# EAGLE design ddrive-esp-deadrail-1-6 (EAGLE 7.5.0)
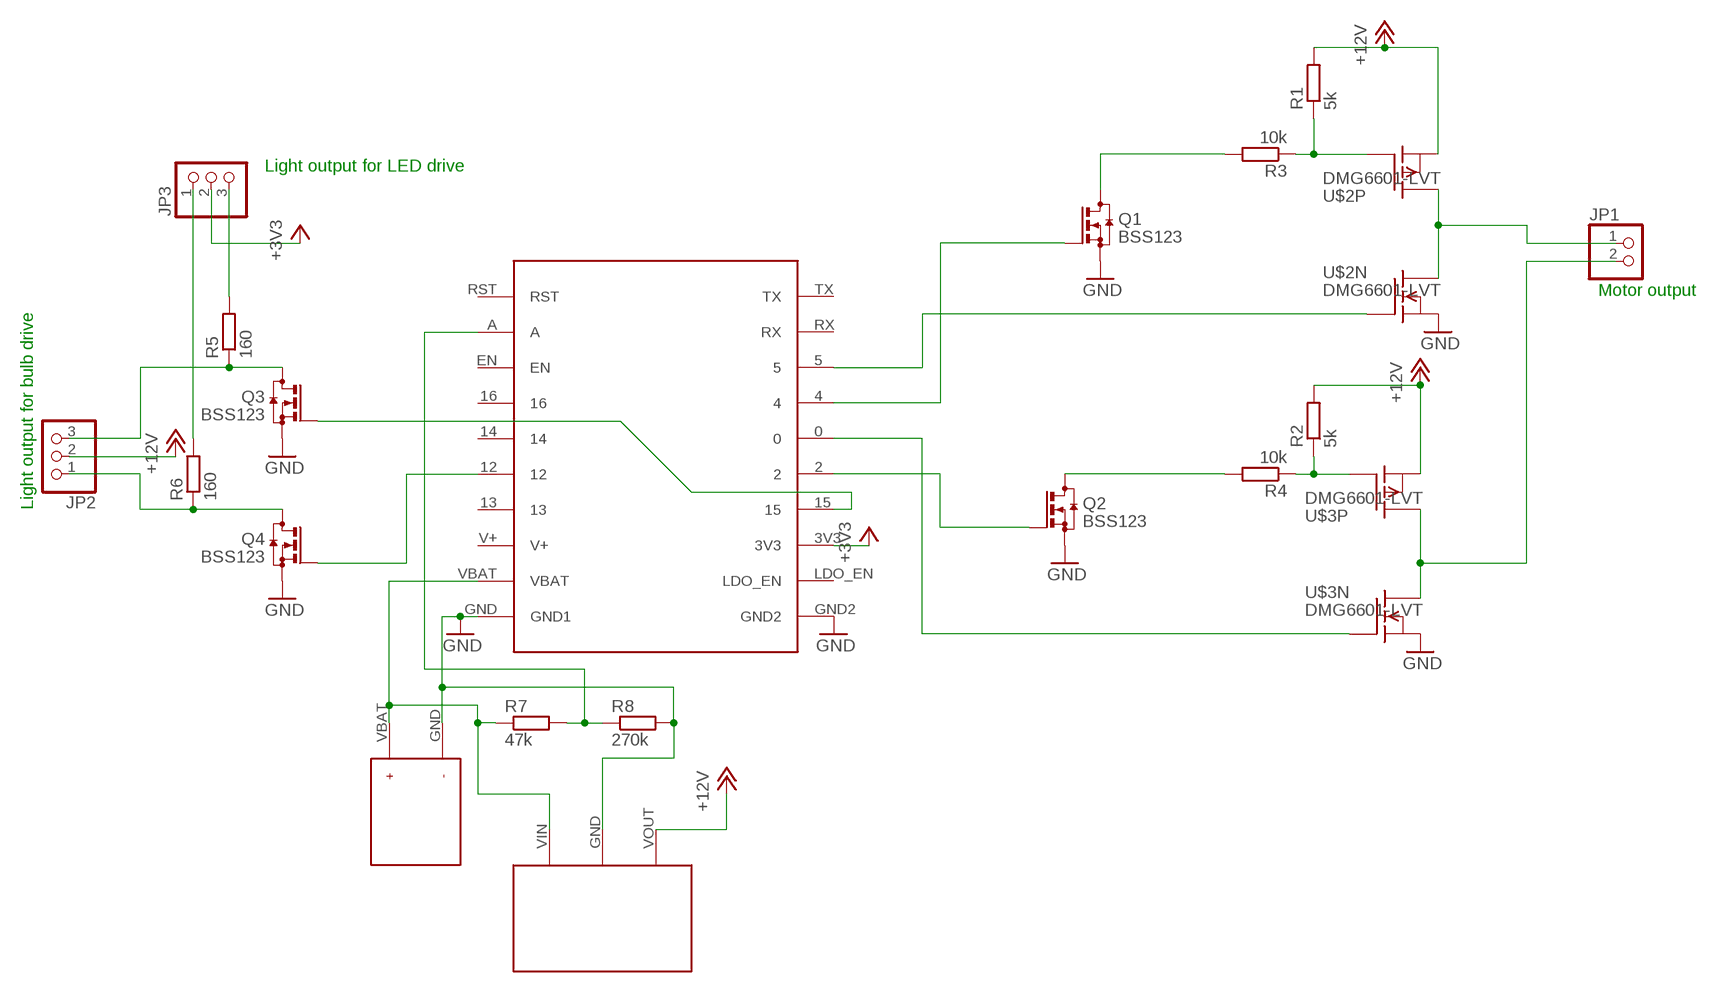
[diagram p0: schematic, sheet 1]

## Parts
JP1  PINHD-1X2  [1X02]
JP2  PINHD-1X3  [1X03]
JP3  PINHD-1X3  [1X03]
Q1  BSS123  [SOT23]
Q2  BSS123  [SOT23]
Q3  BSS123  [SOT23]
Q4  BSS123  [SOT23]
R1  5k  R-EU_R0805  [R0805]
R2  5k  R-EU_R0805  [R0805]
R3  10k  R-EU_R0805  [R0805]
R4  10k  R-EU_R0805  [R0805]
R5  160  R-EU_R0805  [R0805]
R6  160  R-EU_R0805  [R0805]
R7  47k  R-EU_R0805  [R0805]
R8  270k  R-EU_R0805  [R0805]
U$1  ESP12-HUZZAH  [ESP12-HUZZAH]
U$2  DMG6601-LVT  [TSOT-26]
U$3  DMG6601-LVT  [TSOT-26]
U$4  JST-PINHD  [JST-PINHDR]
U$5  POLOLU-VREG12  [POLOLU-REGULATOR]

## Nets
+3V3: JP3.2 U$1.3V3
+12V: JP2.2 R1.2 R2.2 U$2.2(P:S) U$3.2(P:S) U$5.VOUT
GND: Q1.2(S) Q2.2(S) Q3.2(S) Q4.2(S) R8.2 U$1.GND2 U$1.GND(GND1) U$2.5(N:S) U$3.5(N:S) U$4.GND U$5.GND
N$1: JP1.1 U$2.4(P:D) U$2.6(N:D)
N$2: R1.1 R3.1 U$2.3(P:G)
N$3: Q2.3(D) R4.2
N$4: R2.1 R4.1 U$3.3(P:G)
N$5: Q1.1(G) U$1.4
N$6: Q1.3(D) R3.2
N$7: JP1.2 U$3.4(P:D) U$3.6(N:D)
N$8: U$1.5 U$2.1(N:G)
N$9: Q2.1(G) U$1.2
N$10: U$1.0 U$3.1(N:G)
N$11: Q3.1(G) U$1.15
N$12: Q4.1(G) U$1.12
N$13: JP2.3 Q3.3(D) R5.1
N$14: JP2.1 Q4.3(D) R6.1
N$15: JP3.3 R5.2
N$16: JP3.1 R6.2
N$19: R7.2 R8.1 U$1.A
VBAT: R7.1 U$1.VBAT U$4.VBAT U$5.VIN
Unconnected: U$1.13 U$1.14 U$1.16 U$1.EN U$1.LDO_EN U$1.RST U$1.RX U$1.TX

## Notes on the sheet
- Light output for LED drive
- Motor output
- Light output for bulb drive

## Power pins joined to a net without a drawn wire
V+: U$1.V+

## Library data of the parts
JP1 = pinhead:PINHD-1X2: PIN HEADER
JP2 JP3 = pinhead:PINHD-1X3: PIN HEADER
Q1-Q4 = transistor-small-signal:BSS123: N-CHANNEL MOS FET
R1-R8 = rcl:R-EU_: RESISTOR, European symbol
U$1 = trainlib:ESP12-HUZZAH
U$2 U$3 = trainlib:DMG6601-LVT: Dual N+P-channel MOSFET. Package: TSOT-26 Vmax=30V N-channel: 55mOhm, 3.8A Imax P-channel: 110mOhm, 2.5A Imax
U$4 = trainlib:JST-PINHD
U$5 = trainlib:POLOLU-VREG12

## Board
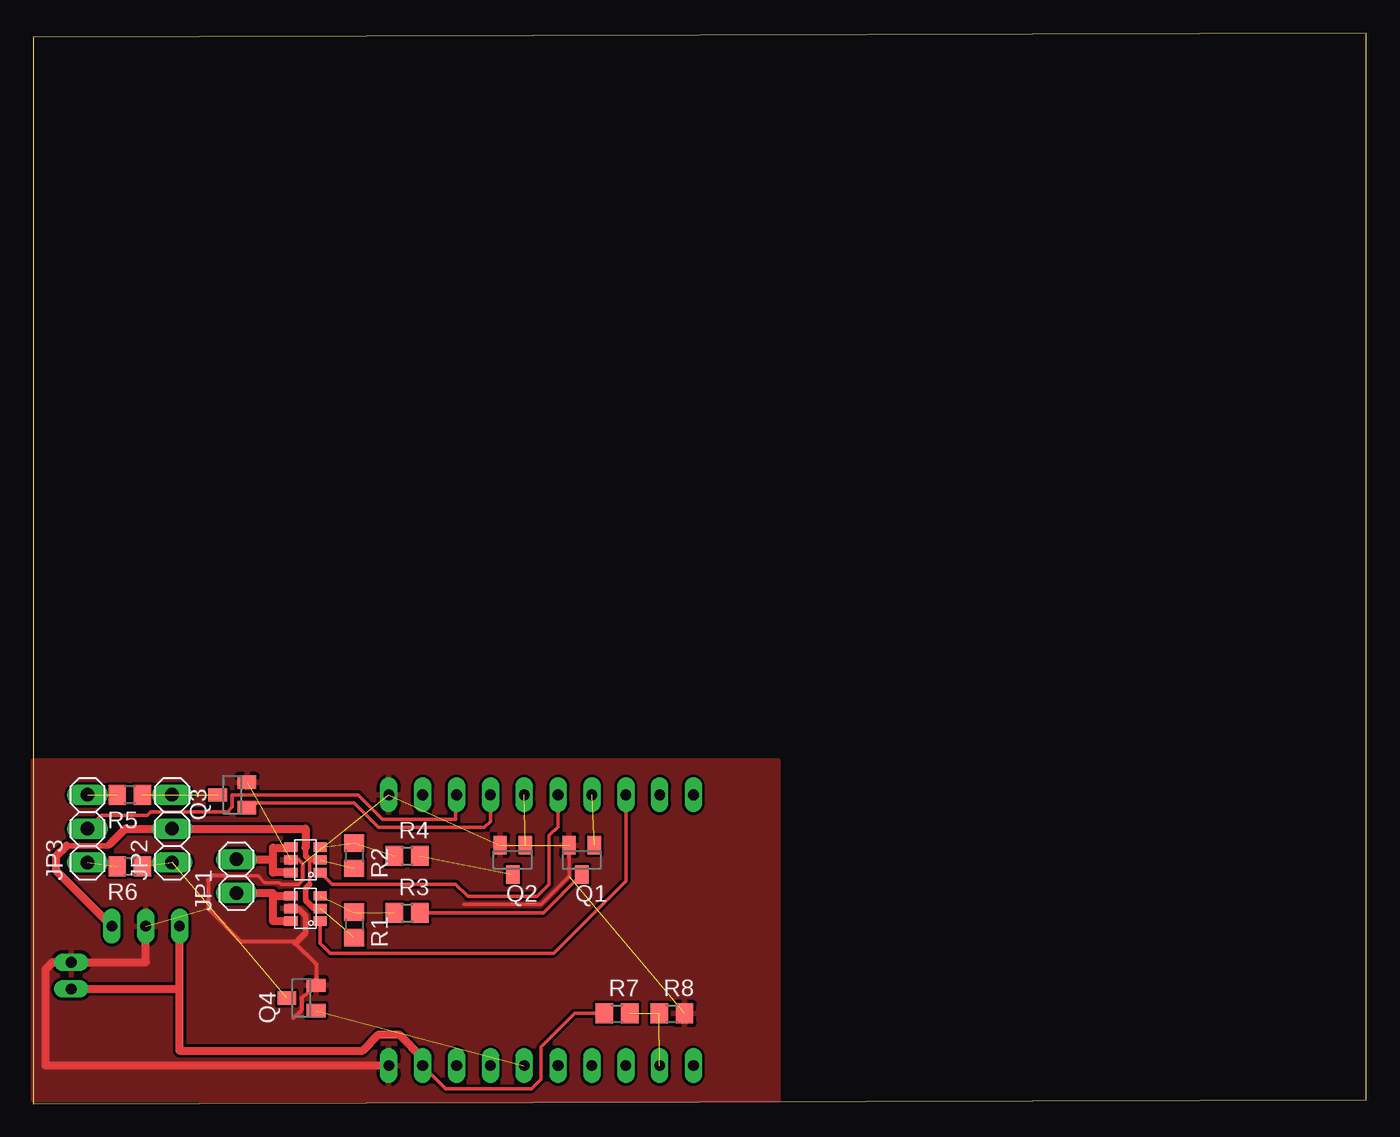
[diagram p1: board, top side]
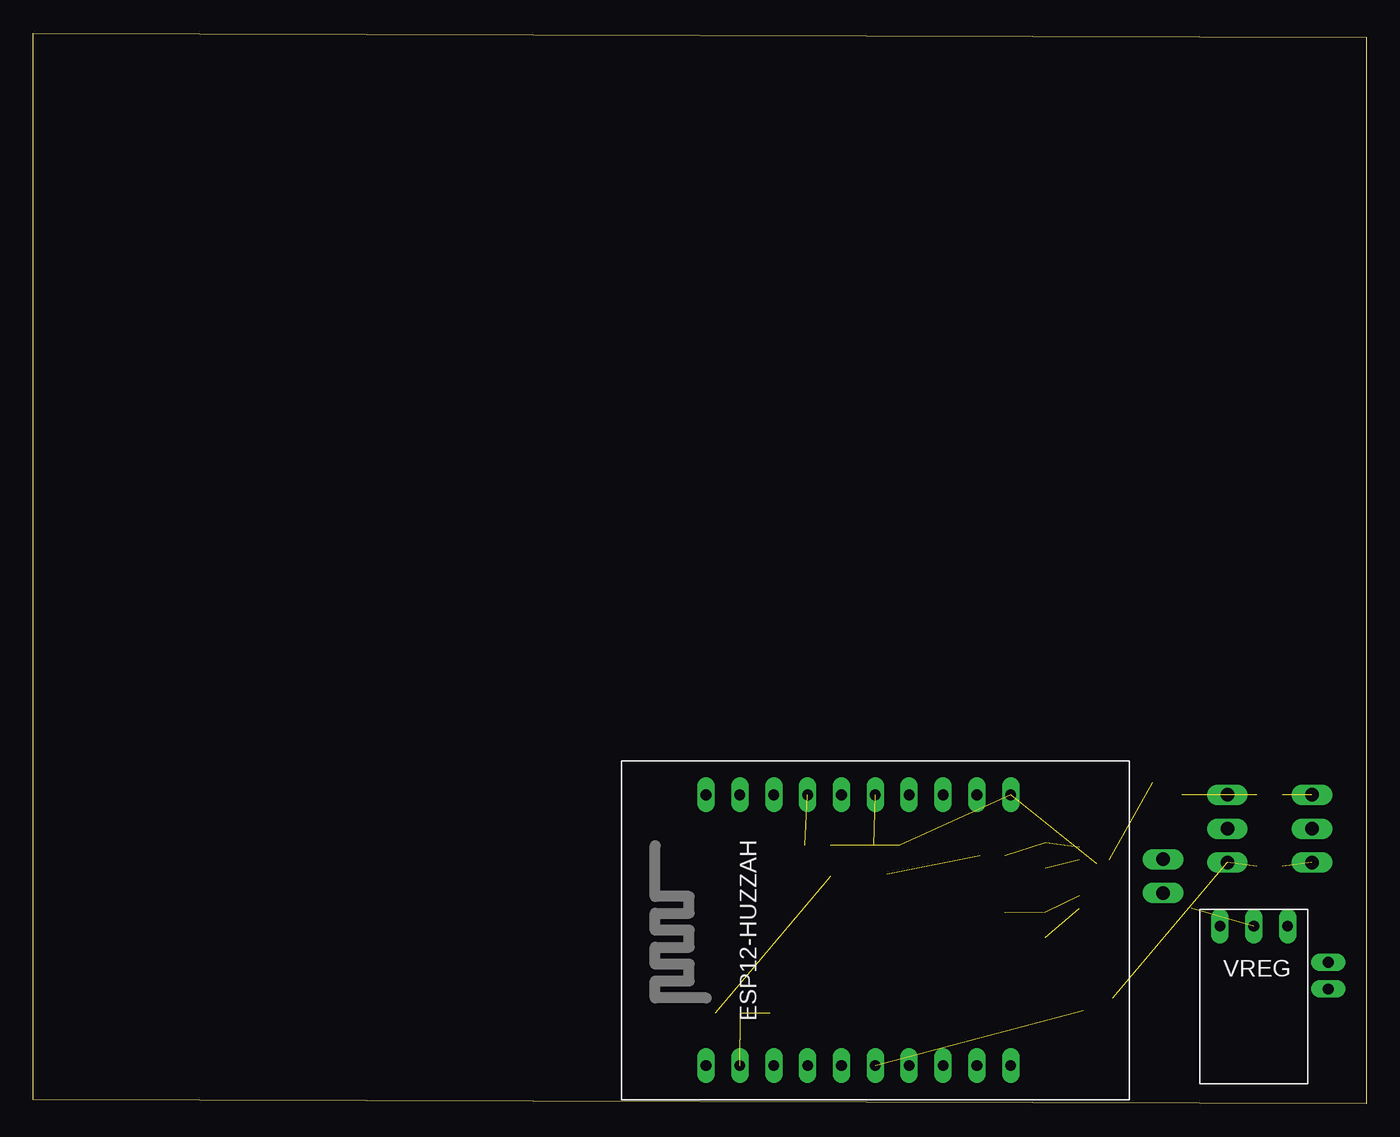
[diagram p2: board, bottom side, seen from below]

Size 100 x 80.3 mm. Coordinates in mm from the lower left corner, seen from the top.
Outline: 0,0 100,0.3 100,80.3 0,80 0,0
Copper layers (1*16): Top 0.035mm / dielectric 1.5mm / Bottom 0.035mm
Design rules "self-etch": minimum track width 8mil, minimum drill 24mil, track to track 8mil, track to pad 8mil, pad to pad 8mil, via to via 8mil, smd to smd 0mil, copper to edge 0mil, drill to drill 8mil, minimum pad ring 10mil, minimum via ring 8mil, stop-mask expansion 4mil, vias tented up to drill 0mil, thermal gap 10mil

### Footprints (pad centres in the part's own frame; a part is rotated, then mirrored left to right if it is on the bottom)
1X02 = drill 1.016 long: 1 -1.27,0; 2 1.27,0
1X03 = drill 1.016 long: 1 -2.54,0; 2 0,0; 3 2.54,0
SOT23 = smd 1 x 1.4: 1 -0.95,-1.1; 2 0.95,-1.1; 3 0,1.1
R0805 = smd 1.3 x 1.5: 1 -0.95,0; 2 0.95,0
ESP12-HUZZAH = drill 0.8 long: 0 10.16,2.54; 2 10.16,0; 3V3 10.16,-5.08; 4 10.16,5.08; 5 10.16,7.62; 12 -10.16,0; 13 -10.16,-2.54; 14 -10.16,2.54; 15 10.16,-2.54; 16 -10.16,5.08; A -10.16,10.16; EN -10.16,7.62; GND -10.16,-10.16; GND2 10.16,-10.16; LDO_EN 10.16,-7.62; RST -10.16,12.7; RX 10.16,10.16; TX 10.16,12.7; V+ -10.16,-5.08; VBAT -10.16,-7.62
TSOT-26 = smd 0.7 x 1: 1 -0.95,-1.1; 2 0,-1.1; 3 0.95,-1.1; 4 0.95,1.1; 5 0,1.1; 6 -0.95,1.1
JST-PINHDR = drill 0.8 long: GND -1,0; VBAT 1,0
POLOLU-REGULATOR = drill 0.8 long: GND 4.064,1.27; VIN 6.604,1.27; VOUT 1.524,1.27

### Placement (x,y rotation side)
JP1  15.24,17.07 90 top
JP2  10.41,20.62 90 top
JP3  4.06,20.62 90 top
Q1  41.15,18.29 180 top
Q2  35.97,18.29 180 top
Q3  14.94,23.16 90 top
Q4  20.12,7.92 90 top
R1  24.08,13.41 270 top
R2  24.08,18.59 270 top
R3  28.04,14.33 0 top
R4  28.04,18.59 0 top
R5  7.24,23.16 180 top
R6  7.24,17.78 180 top
R7  43.79,6.76 0 top
R8  47.9,6.76 0 top
U$1  36.83,13 90 bottom
U$2  20.42,14.63 90 top
U$3  20.42,18.29 90 top
U$4  2.84,9.6 270 top
U$5  4.37,14.58 180 bottom

### Tracks (layer width: path | path; a pad name or v marks a point on that pad's centre or on a via)
+3V3
  Top 0.254: U$1.3V3 31.7,23.11 31.7,21.34 26.21,21.34 24.38,23.16 14.94,23.16 14.94,22.25 14.58,21.89 8.79,21.89 8.53,21.64 5.08,21.64 JP3.2
+12V  (2 unrouted)
  Top 0.254: 20.73,18.29 20.73,16.46 | 21.03,14.63 U$2.2
  Top 0.406: 20.42,19.2 20.42,18.59 20.73,18.29 U$3.2 | 20.73,16.46 20.42,16.15 20.42,15.24 21.03,14.63 | 2.49,19.35 5.64,19.35 5.79,19.51
  Top 0.61: 20.42,19.2 20.42,20.62 JP2.2 6.91,20.62 5.79,19.51 | U$5.VOUT 1.73,17.47 1.73,18.59 2.49,19.35
GND  (6 unrouted)
  Top 0.254: U$3.5 19.91,18.29 20.22,17.98 20.22,16.76 19.91,16.46 18.59,16.46 18.49,16.56 17.37,16.56 16.87,17.07 14.33,17.07 | Q1.2 40.2,17.03 38.1,14.93 32.31,14.93
  Top 0.305: 14.33,17.07 13.41,17.07 13.11,16.76 13.11,14.63 15.54,12.19 19.51,12.19 19.66,12.04 21.22,10.48 Q4.2 21.38,8.84 | 21.38,8.84 21.34,8.84 | 21.38,8.84 20.12,7.92 20.12,7.01 19.51,6.4
  Top 0.406: U$2.5 19.86,14.63 20.42,14.07 20.42,12.8 19.66,12.04
  Top 0.61: U$5.GND 8.43,10.6 U$4.GND 1.46,10.6 0.91,10.06 0.91,2.84 U$1.GND
  pour Top: 0,25.7 55.88,25.7 55.88,0.3 0,0.3
N$1
  Top 0.61: U$2.6 17.98,13.68 17.98,15.58 | 17.98,15.58 U$2.4 | JP1.1 17.98,15.8 17.98,15.58
N$2  (2 unrouted)
N$3  (1 unrouted)
N$4  (2 unrouted)
N$5  (1 unrouted)
N$6
  Top 0.254: R3.2 38.29,14.33 Q1.3
N$7
  Top 0.61: U$3.6 17.98,17.34 17.98,18.29 17.98,18.34 | 17.98,18.34 17.98,19.2 19.32,19.2 U$3.4 | JP1.2 17.98,18.34
N$8
  Top 0.254: U$1.5 44.45,16.71 39.01,11.28 22.25,11.28 21.52,12.01 U$2.1
N$9  (1 unrouted)
N$10
  Top 0.254: U$1.0 39.37,20.78 38.71,20.12 38.71,16.46 37.8,15.54 32.61,15.54 31.7,16.46 22.4,16.46 U$3.1
N$11
  Top 0.254: U$1.15 34.29,21.18 33.83,20.73 25.91,20.73 24.08,22.55 16.38,22.55 Q3.1
N$12  (1 unrouted)
N$13  (2 unrouted)
N$14  (2 unrouted)
N$15  (1 unrouted)
N$16  (1 unrouted)
N$19  (2 unrouted)
VBAT
  Top 0.254: U$1.VBAT 30.94,1.12 37.39,1.12 38.1,1.83 38.1,4.27 40.59,6.76 R7.1
  Top 0.61: U$1.VBAT 29.21,3.4 27.43,5.18 25.91,5.18 24.69,3.96 10.97,3.96 10.97,8.6 | U$4.VBAT 10.97,8.6 | 10.97,8.6 U$5.VIN